# EAGLE design temperature_sensor (EAGLE 8.2.2)
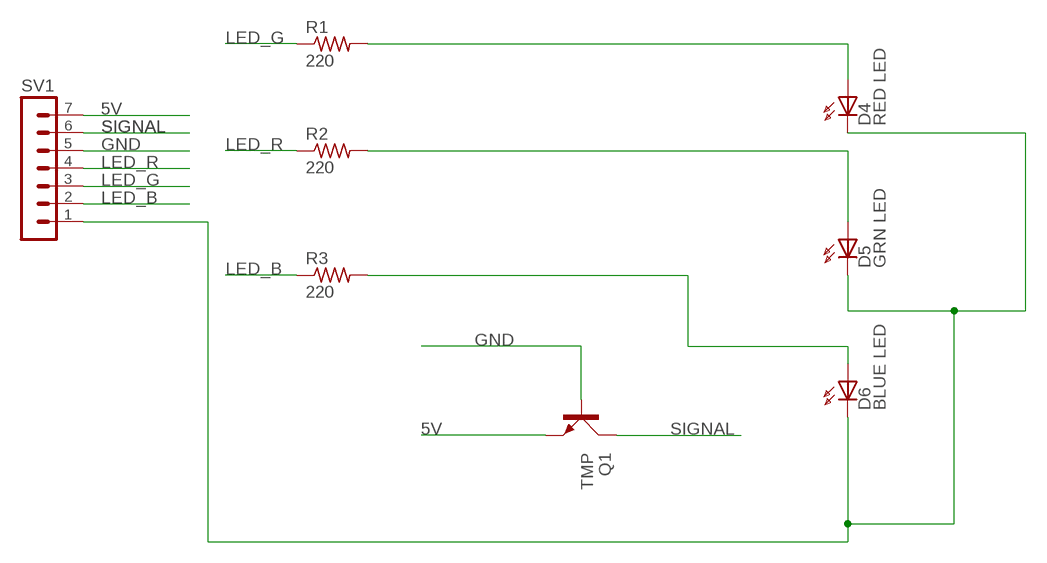
[diagram p0: schematic, sheet 1]

## Parts
D4  RED LED  HLMP6  [HLMP6]
D5  GRN LED  HLMP6  [HLMP6]
D6  BLUE LED  HLMP6  [HLMP6]
Q1  TMP  BD139  [TO126AV]
R1  220  R-US_R1206  [R1206]
R2  220  R-US_R1206  [R1206]
R3  220  R-US_R1206  [R1206]
SV1  MA07-1  [MA07-1]

## Nets
5V: Q1.E SV1.7
GND: Q1.B SV1.5
GND2: D4.K D5.K D6.K SV1.1
LED_B: R3.1 SV1.2
LED_G: R1.1 SV1.3
LED_R: R2.1 SV1.4
N$2: D6.A R3.2
N$4: D5.A R2.2
N$5: D4.A R1.2
SIGNAL: Q1.C SV1.6

## Library data of the parts
D4-D6 = display-hp:HLMP6: LED 2mm horizontal; MF: AGILENT TECHNOLOGIES; MPN: HLMP-6500; OC_FARNELL: 1652490; OC_NEWARK: 40K0088
Q1 = transistor-power:BD139: NPN TRANSISTOR
R1-R3 = resistor:R-US_: RESISTOR, American symbol
SV1 = con-lstb:MA07-1: PIN HEADER; OC_FARNELL: unknown; OC_NEWARK: unknown

## Board
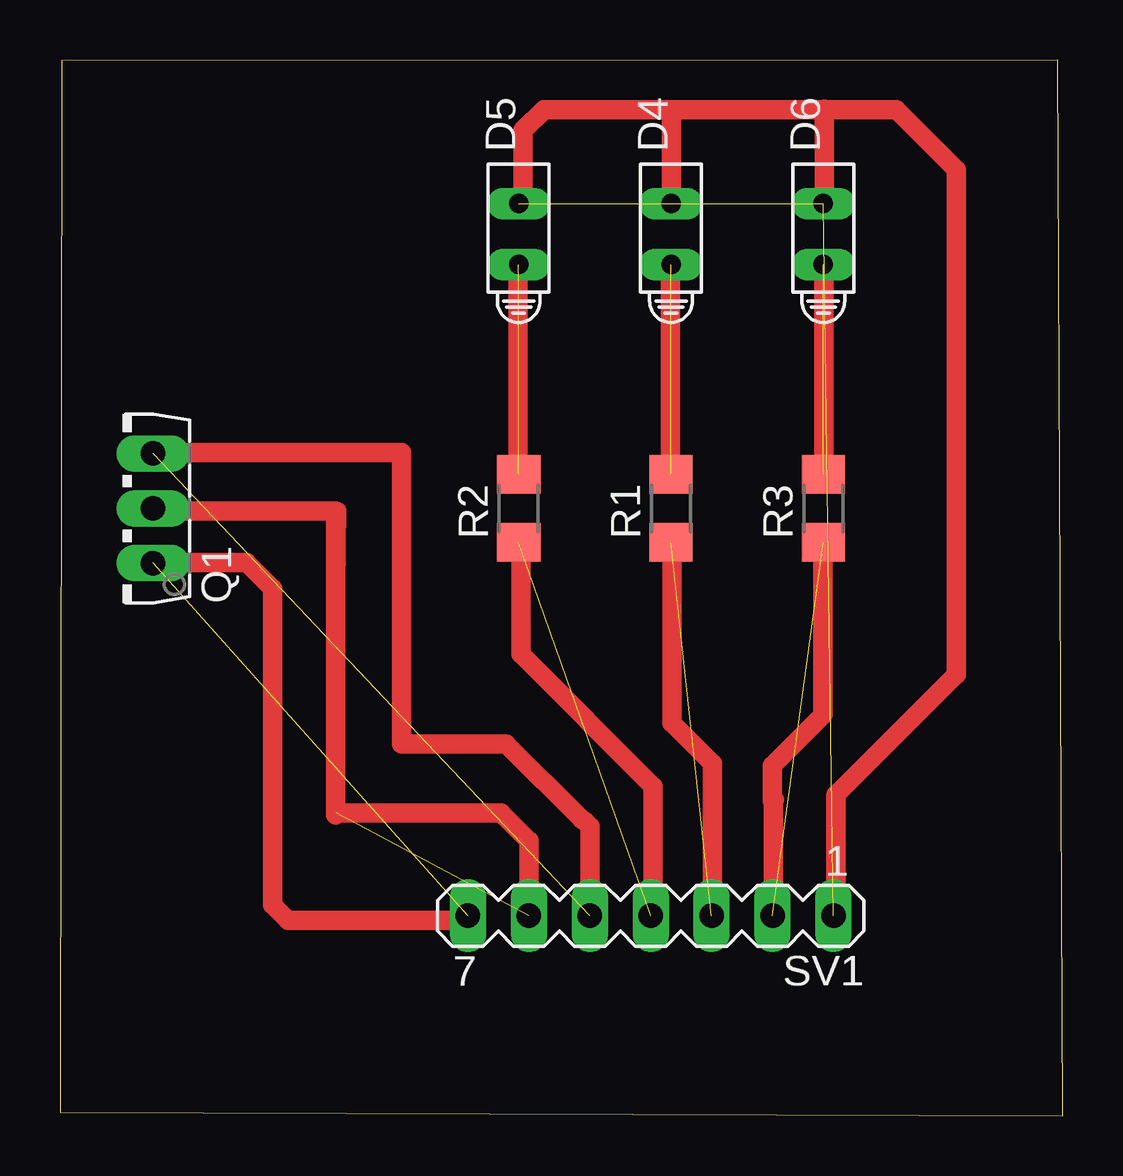
[diagram p1: board, top side]

Size 41.81 x 44.01 mm. Coordinates in mm from the lower left corner, seen from the top.
Outline: 0,0.15 41.81,0 41.6,44.01 0.08,43.97 0,0.15
Copper layers (1*16): Top 0.035mm / dielectric 1.5mm / Bottom 0.035mm
Design rules "default": minimum track width 6mil, minimum drill 0.35mm, track to track 6mil, track to pad 6mil, pad to pad 6mil, via to via 6mil, smd to smd 6mil, copper to edge 40mil, drill to drill 6mil, minimum pad ring 10mil, minimum via ring 8mil, stop-mask expansion 4mil, vias tented up to drill 0mil, thermal gap 10mil

### Footprints (pad centres in the part's own frame; a part is rotated, then mirrored left to right if it is on the bottom)
HLMP6 = drill 0.813 long: A -1.27,0; K 1.27,0
TO126AV = drill 1.016 long: B 2.286,-1.27; C 0,-1.27; E -2.286,-1.27
R1206 = smd 1.6 x 1.803: 1 -1.422,0; 2 1.422,0
MA07-1 = drill 1.016 long: 1 -7.62,0; 2 -5.08,0; 3 -2.54,0; 4 0,0; 5 2.54,0; 6 5.08,0; 7 7.62,0

### Placement (x,y rotation side)
D4  25.47,36.75 90 top
D5  19.12,36.75 90 top
D6  31.82,36.75 90 top
Q1  2.61,25.32 90 top
R1  25.47,25.32 90 top
R2  19.12,25.32 90 top
R3  31.82,25.32 90 top
SV1  24.63,8.34 180 top

### Tracks (layer width: path | path; a pad name or v marks a point on that pad's centre or on a via)
5V  (1 unrouted)
GND  (1 unrouted)
GND2  (3 unrouted)
LED_B  (1 unrouted)
LED_G  (1 unrouted)
LED_R  (1 unrouted)
N$1
  Top 0.813: 19.31,38.13 19.31,41.08 20.17,41.93 34.87,41.93 37.37,39.43 37.37,18.4 32.34,13.37 32.34,8.27
N$2  (1 unrouted)
  Top 0.508: 31.82,26.59 D6.A
N$3
  Top 0.813: 25.47,38.01 25.49,38.03 25.49,41.78
N$4  (1 unrouted)
  Top 0.508: 19.12,26.59 D5.A
N$5  (1 unrouted)
  Top 0.508: 25.47,26.59 D4.A
N$6
  Top 0.813: 31.82,38.03 31.86,38.07 31.86,41.96
N$7
  Top 0.813: 19.04,26.68 19.1,26.74 19.1,35.54
N$8
  Top 0.813: 25.56,26.68 25.44,26.8 25.44,35.51
N$9
  Top 0.813: 31.87,26.85 31.84,26.88 31.84,35.42
N$10
  Top 0.813: 29.75,8.47 29.75,13.16 29.79,13.16
N$11
  Top 0.813: 29.7,13.12 29.7,14.6 31.8,16.7 31.8,23.9
N$12
  Top 0.813: 27.11,8.47 27.19,8.55 27.19,14.68 25.51,16.37 25.51,23.74
N$13
  Top 0.813: 24.73,8.22 24.73,13.74 19.21,19.25 19.21,23.98
N$14
  Top 0.813: 17.06,8.15 9.51,8.15 8.86,8.79 8.86,21.98 7.78,23.06 3.83,23.06
N$15
  Top 0.813: 19.61,8.37 19.54,8.44 19.54,11.45 18.38,12.62 11.56,12.62 arc90 11.49,12.55 11.49,25.19 arc90 11.46,25.22 3.85,25.22 3.85,25.32
N$16
  Top 0.813: 3.78,27.65 14.25,27.65 14.25,15.51 18.59,15.51 21.75,12.35
N$17
  Top 0.813: 21.88,12.28 22.09,12.07 22.09,8.16
SIGNAL  (1 unrouted)
  Top 0.508: Q1.C 11.67,25.31 11.5,12.62 17.79,12.62